# Altium schematic sheet P_MiniPCIE.SchDoc
size 209 x 297 mm; Author: ALTIUM GOSTBOM2.0 KEV; SheetNumber: 24; SheetTotal: 48
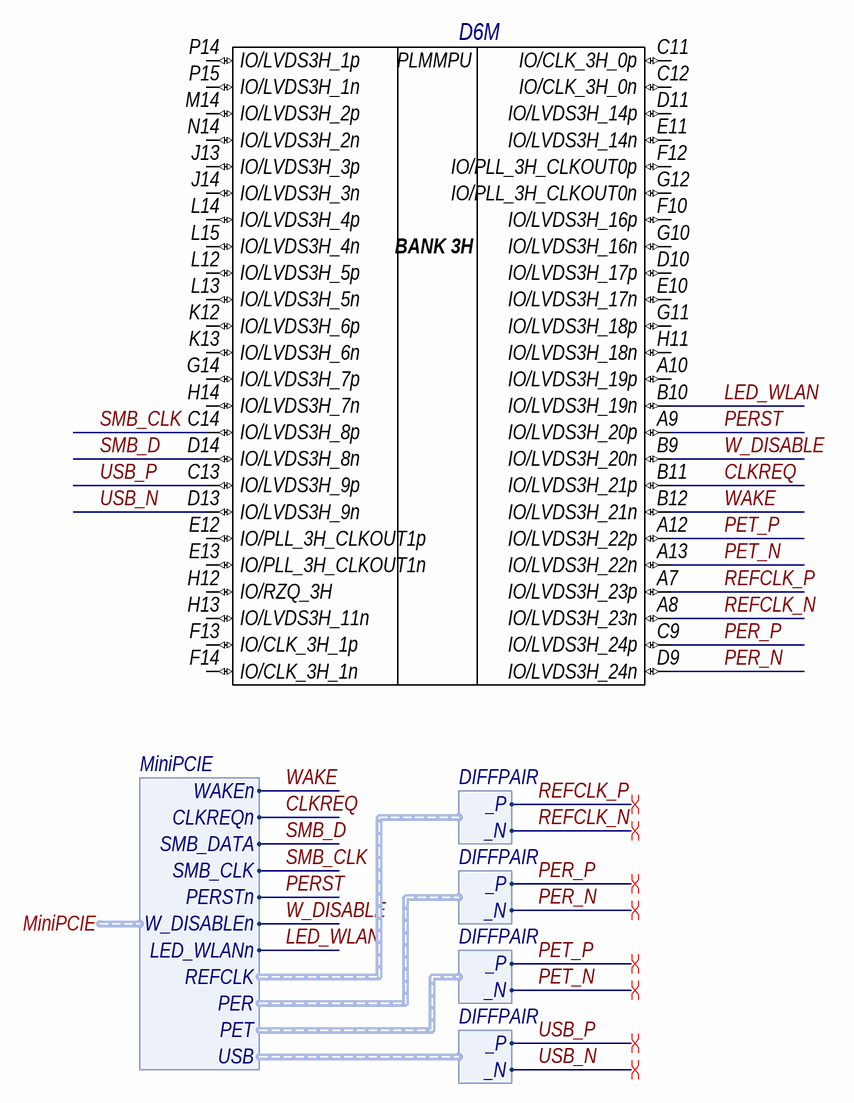
[diagram p0: P_MiniPCIE.SchDoc]

## Parts
D6  10AS066N3F40E2SGE2  [ALTR-FBGA1517_A-350]  (value not drawn)  (part M of 39)

## Ports
MiniPCIE (harness MiniPCIE)

## Harnesses
MiniPCIE: WAKEn, CLKREQn, SMB_DATA, SMB_CLK, PERSTn, W_DISABLEn, LED_WLANn, REFCLK, PER, PET, USB
DIFFPAIR: _P, _N

## Nets
CLKREQ: D6.B11(IO/LVDS3H_21p) ; port MiniPCIE.CLKREQn
LED_WLAN: D6.B10(IO/LVDS3H_19n) ; port MiniPCIE.LED_WLANn
PER_N: D6.D9(IO/LVDS3H_24n) ; harness DIFFPAIR._N
PER_P: D6.C9(IO/LVDS3H_24p) ; harness DIFFPAIR._P
PERST: D6.A9(IO/LVDS3H_20p) ; port MiniPCIE.PERSTn
PET_N: D6.A13(IO/LVDS3H_22n) ; harness DIFFPAIR._N
PET_P: D6.A12(IO/LVDS3H_22p) ; harness DIFFPAIR._P
REFCLK_N: D6.A8(IO/LVDS3H_23n) ; harness DIFFPAIR._N
REFCLK_P: D6.A7(IO/LVDS3H_23p) ; harness DIFFPAIR._P
SMB_CLK: D6.C14(IO/LVDS3H_8p) ; port MiniPCIE.SMB_CLK
SMB_D: D6.D14(IO/LVDS3H_8n) ; port MiniPCIE.SMB_DATA
USB_N: D6.D13(IO/LVDS3H_9n) ; harness DIFFPAIR._N
USB_P: D6.C13(IO/LVDS3H_9p) ; harness DIFFPAIR._P
W_DISABLE: D6.B9(IO/LVDS3H_20n) ; port MiniPCIE.W_DISABLEn
WAKE: D6.B12(IO/LVDS3H_21n) ; port MiniPCIE.WAKEn

Not connected (* = marked no-connect by the designer): D6 A10(IO/LVDS3H_19p) C11(IO/CLK_3H_0p) C12(IO/CLK_3H_0n) D10(IO/LVDS3H_17p) D11(IO/LVDS3H_14p) E10(IO/LVDS3H_17n) E11(IO/LVDS3H_14n) E12(IO/PLL_3H_CLKOUT1p) E13(IO/PLL_3H_CLKOUT1n) F10(IO/LVDS3H_16p) F12(IO/PLL_3H_CLKOUT0p) F13(IO/CLK_3H_1p) F14(IO/CLK_3H_1n) G10(IO/LVDS3H_16n) G11(IO/LVDS3H_18p) G12(IO/PLL_3H_CLKOUT0n) G14(IO/LVDS3H_7p) H11(IO/LVDS3H_18n) H12(IO/RZQ_3H) H13(IO/LVDS3H_11n) H14(IO/LVDS3H_7n) J13(IO/LVDS3H_3p) J14(IO/LVDS3H_3n) K12(IO/LVDS3H_6p) K13(IO/LVDS3H_6n) L12(IO/LVDS3H_5p) L13(IO/LVDS3H_5n) L14(IO/LVDS3H_4p) L15(IO/LVDS3H_4n) M14(IO/LVDS3H_2p) N14(IO/LVDS3H_2n) P14(IO/LVDS3H_1p) P15(IO/LVDS3H_1n)

## Layout directives
differential pair: PER_N, PER_P, PET_N, PET_P, REFCLK_N, REFCLK_P, USB_N, USB_P

## Notes on the sheet
- Подп. дата
- Инв. № дубл.
- Взам. инв. №
- Подп. и дата
- Инв. № подл.
- Изм.
- Лист
- № докум.
- Подп.
- Дата
- Файл:
- ALTIUM GOSTBOM2.0 KEV
- Копировал
- Формат А4
- (in symbol E105, part M) PLMMPU; BANK 3H

## Library data of the parts
D6 = E105: Arria 10 SX Family, 588 I/O Pins, 16 Fractional PLLs, 1517-Pin FBGA, Speed Grade 2, Extended Grade, RoHS; Тип элемента: ПЛИС; Old_des: U1; New_des: D6; UID: E105; Component Kind: Standard; ComponentLink1Description: Manufacturer URL; ComponentLink1URL: https://www.altera.com/; ComponentLink2Description: Datasheet; ComponentLink2URL: https://www.altera.com/content/dam/altera-www/global/en_US/pdfs/literature/hb/arria-10/a10_datasheet.pdf; DatasheetVersion: Rev. 2016-06-24, 06/2016; Mounting Technology: Surface Mount; PackageDescription: 1517-Pin FineLine Ball-Grid Array (FBGA), Body 40 x 40 mm, Pitch 1 mm; PartNumber: 10AS066N3F40E2SGE2; Code_JEDEC: MS-034; ComponentLink3Description: Package Specification; ComponentLink3URL: https://www.altera.com/content/dam/altera-www/global/en_US/pdfs/literature/packaging/04r00461-04.pdf; PackageVersion: Rev. 5.0, 01/2016